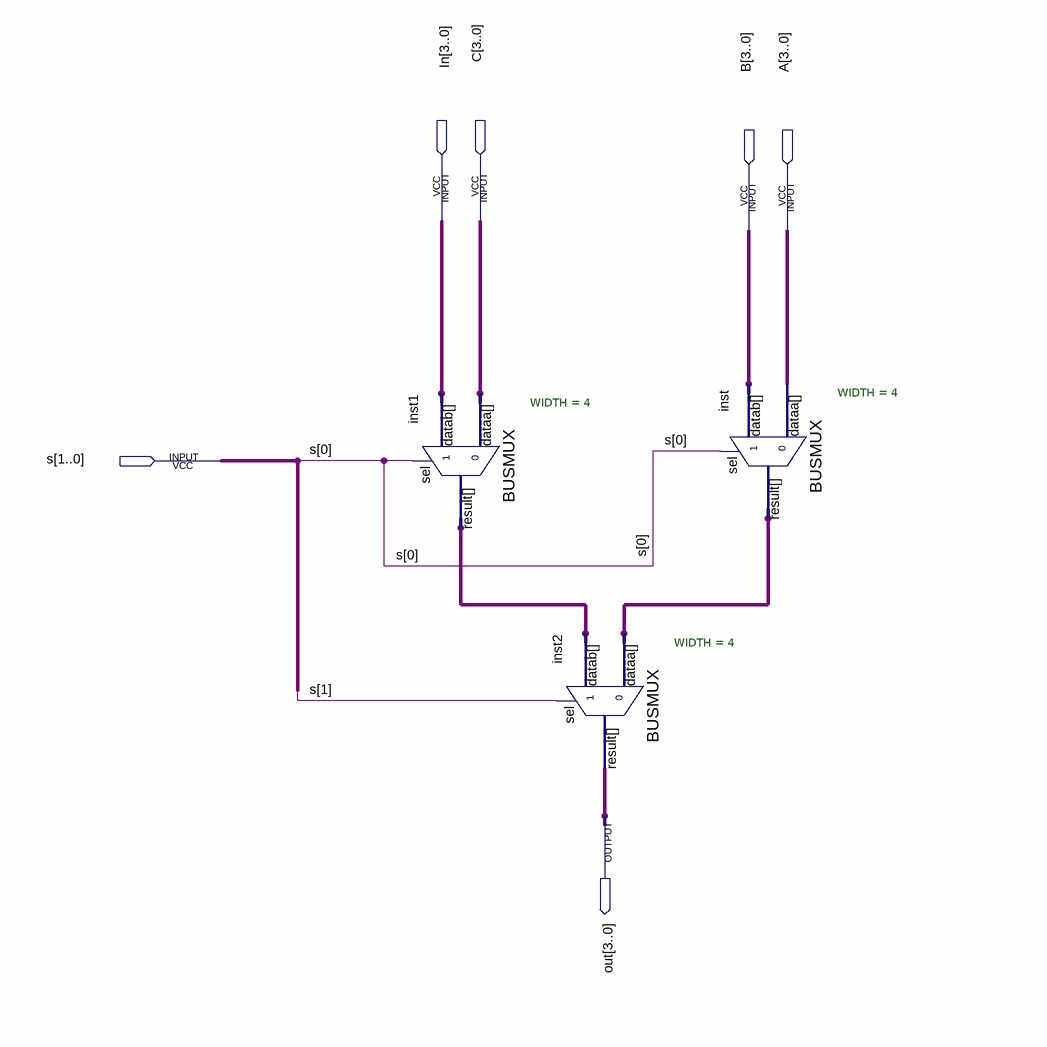
[diagram p0: schematic sheet]
// Quartus schematic fourXOneMux.bdf as structural Verilog: 3 symbols, 6 pins
module fourXOneMux (
  input  [3:0] In,
  input  [3:0] C,
  input  [3:0] B,
  input  [3:0] A,
  input  [1:0] s,
  output [3:0] out
);

  wire [3:0] inst1_result, inst_result;

  BUSMUX #(.WIDTH(4)) inst1 (.datab(In), .sel(s[0]), .dataa(C), .result(inst1_result));
  BUSMUX #(.WIDTH(4)) inst2 (.datab(inst1_result), .sel(s[1]), .dataa(inst_result), .result(out));
  BUSMUX #(.WIDTH(4)) inst (.datab(B), .sel(s[0]), .dataa(A), .result(inst_result));
endmodule
